# Altium project MiniPC.PrjPcb (part 7 of 17)

## Sheet Ethernet-HPS.SchDoc: 10/100/1000 Ethernet - HPS
size B; DocumentNumber: 8; SheetNumber: 8; SheetTotal: 46
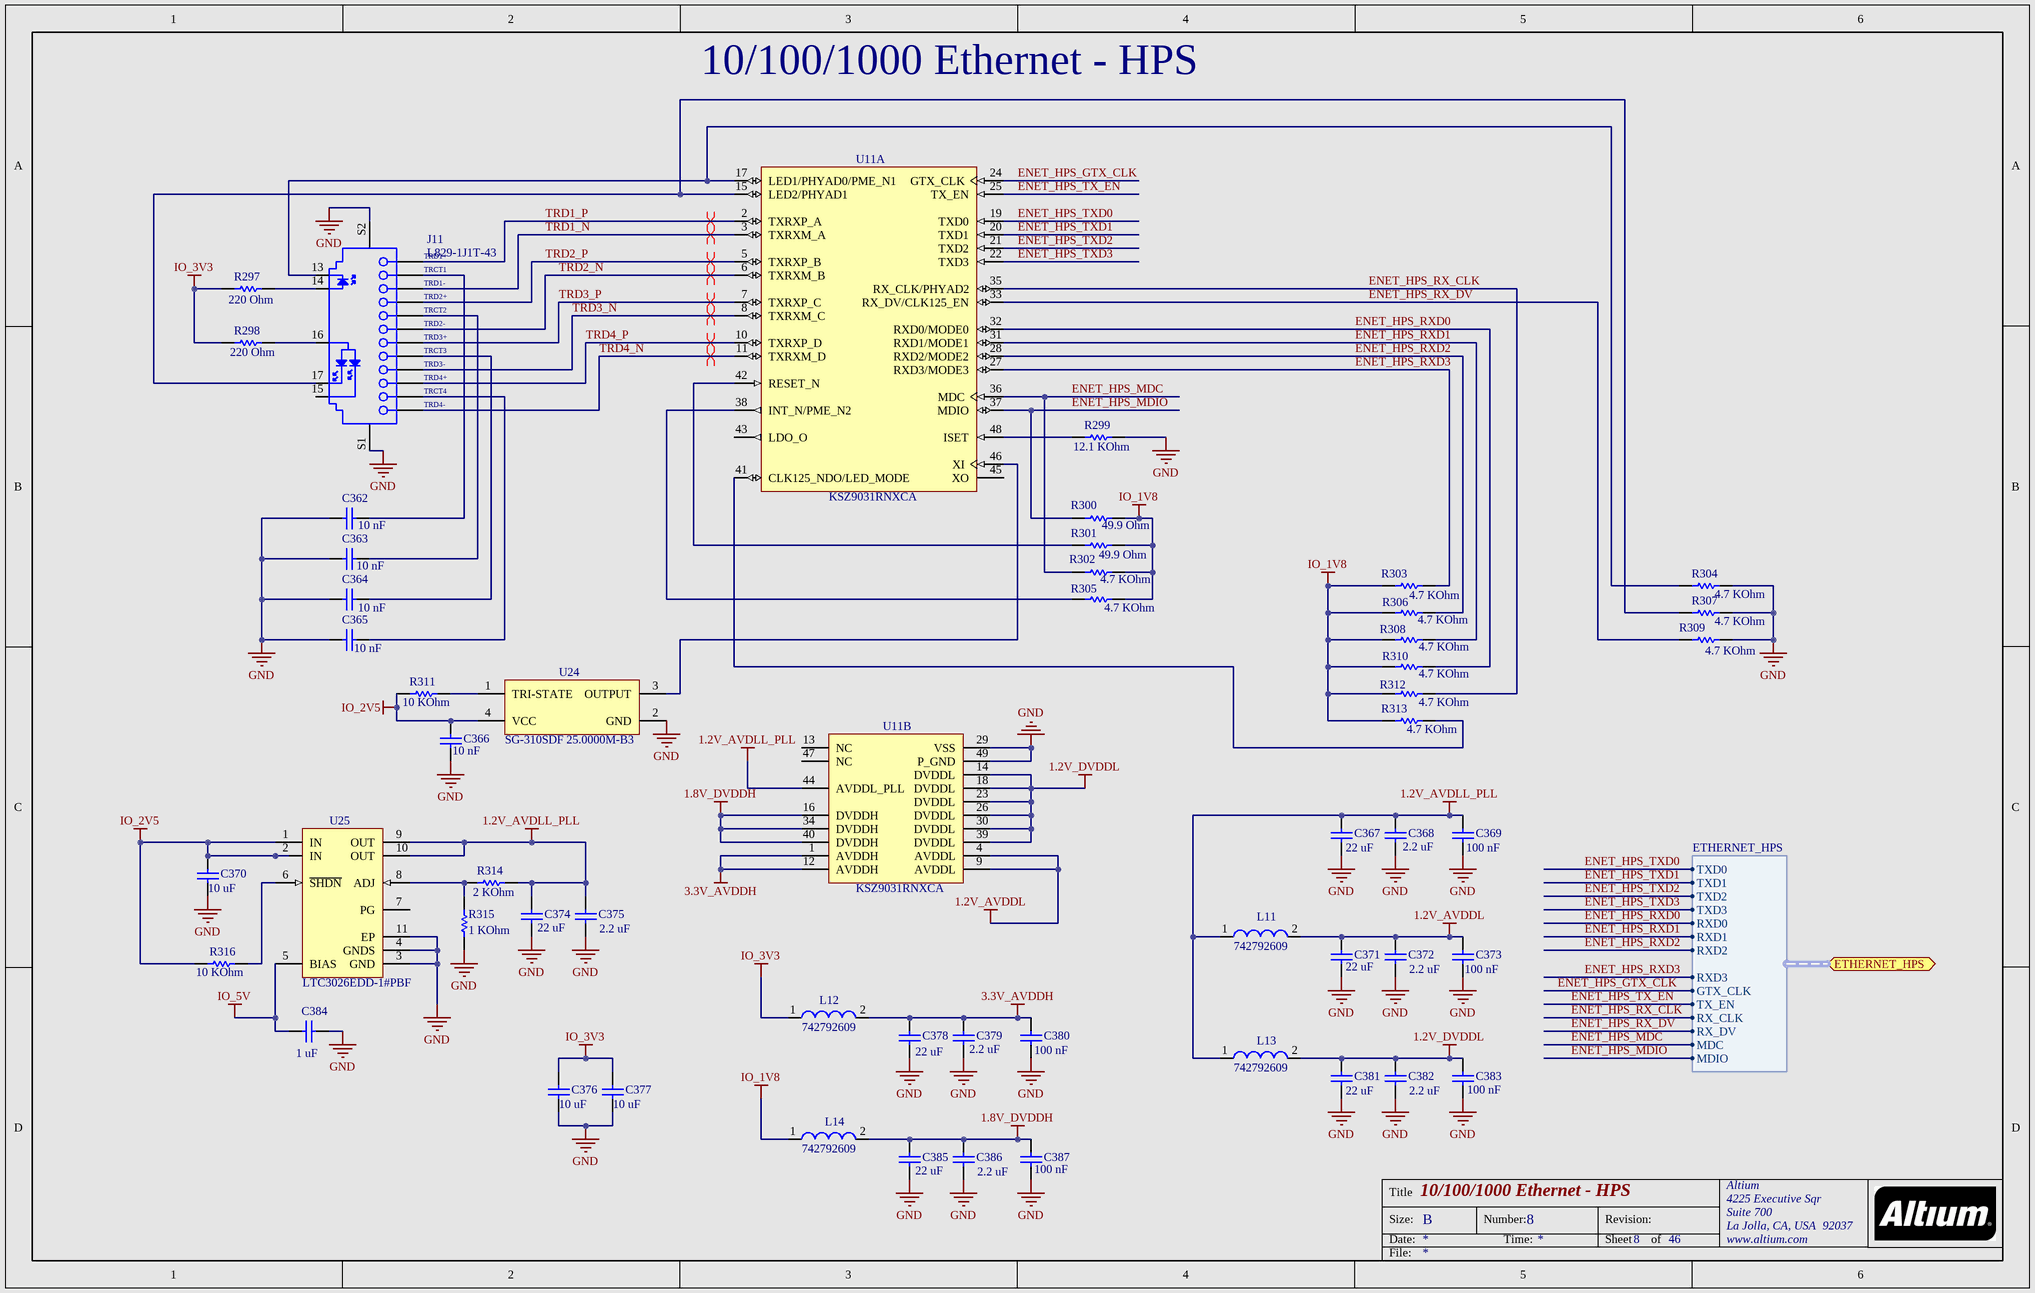
[diagram p24: Ethernet-HPS.SchDoc]

### Parts
C362  Capacitance: 10 nF  [CAPC1005X55X25ML05T10]  (hidden comment: GRM155R71H103KA88D)
C363  Capacitance: 10 nF  [CAPC1005X55X25ML05T10]  (hidden comment: GRM155R71H103KA88D)
C364  Capacitance: 10 nF  [CAPC1005X55X25ML05T10]  (hidden comment: GRM155R71H103KA88D)
C365  Capacitance: 10 nF  [CAPC1005X55X25ML05T10]  (hidden comment: GRM155R71H103KA88D)
C366  Capacitance: 10 nF  [CAPC1005X55X25ML05T10]  (hidden comment: GRM155R71H103KA88D)
C367  Capacitance: 22 uF  [CAPC3216X180X55ML20T25]  (hidden comment: GRM31CR61E226KE15L)
C368  Capacitance: 2.2 uF  [CAPC1608X90X35ML10T15]  (hidden comment: GRM188R61A225KE34x)
C369  Capacitance: 100 nF  [CAPC1005X55X10LL05]  (hidden comment: C1005X7R1E104M)
C370  Capacitance: 10 uF  [CAPC2013X100X20NL20]  (hidden comment: C2012X5R1C106K085AC)
C371  Capacitance: 22 uF  [CAPC3216X180X55ML20T25]  (hidden comment: GRM31CR61E226KE15L)
C372  Capacitance: 2.2 uF  [CAPC1608X90X35ML10T15]  (hidden comment: GRM188R61A225KE34x)
C373  Capacitance: 100 nF  [CAPC1005X55X10LL05]  (hidden comment: C1005X7R1E104M)
C374  Capacitance: 22 uF  [CAPC3216X180X55ML20T25]  (hidden comment: GRM31CR61E226KE15L)
C375  Capacitance: 2.2 uF  [CAPC1608X90X35ML10T15]  (hidden comment: GRM188R61A225KE34x)
C376  Capacitance: 10 uF  [CAPC2013X100X20NL20]  (hidden comment: C2012X5R1C106K085AC)
C377  Capacitance: 10 uF  [CAPC2013X100X20NL20]  (hidden comment: C2012X5R1C106K085AC)
C378  Capacitance: 22 uF  [CAPC3216X180X55ML20T25]  (hidden comment: GRM31CR61E226KE15L)
C379  Capacitance: 2.2 uF  [CAPC1608X90X35ML10T15]  (hidden comment: GRM188R61A225KE34x)
C380  Capacitance: 100 nF  [CAPC1005X55X10LL05]  (hidden comment: C1005X7R1E104M)
C381  Capacitance: 22 uF  [CAPC3216X180X55ML20T25]  (hidden comment: GRM31CR61E226KE15L)
C382  Capacitance: 2.2 uF  [CAPC1608X90X35ML10T15]  (hidden comment: GRM188R61A225KE34x)
C383  Capacitance: 100 nF  [CAPC1005X55X10LL05]  (hidden comment: C1005X7R1E104M)
C384  Capacitance: 1 uF  [CAPC1005X33X10LL5]  (hidden comment: CGB2A1X5R1E105K033BC)
C385  Capacitance: 22 uF  [CAPC3216X180X55ML20T25]  (hidden comment: GRM31CR61E226KE15L)
C386  Capacitance: 2.2 uF  [CAPC1608X90X35ML10T15]  (hidden comment: GRM188R61A225KE34x)
C387  Capacitance: 100 nF  [CAPC1005X55X10LL05]  (hidden comment: C1005X7R1E104M)
J11  L829-1J1T-43  [BELS-L829-1J1T-43_V]
L11  742792609  [SMD-0603]
L12  742792609  [SMD-0603]
L13  742792609  [SMD-0603]
L14  742792609  [SMD-0603]
R297  Resistance: 220 Ohm  [RESC1005X40X25LL05T05]  (hidden comment: ERJ-2GEJ221X)
R298  Resistance: 220 Ohm  [RESC1005X40X25LL05T05]  (hidden comment: ERJ-2GEJ221X)
R299  Resistance: 12.1 KOhm  [RESC1005X40X25LL05T05]  (hidden comment: CRCW040212K1FKED)
R300  Resistance: 49.9 Ohm  [RESC1005X35X25NL8T10]  (hidden comment: NRC04F49R9TRF)
R301  Resistance: 49.9 Ohm  [RESC1005X35X25NL8T10]  (hidden comment: NRC04F49R9TRF)
R302  Resistance: 4.7 KOhm  [RESC1005X40X25LL05T05]  (hidden comment: ERJ-2RKF4701X)
R303  Resistance: 4.7 KOhm  [RESC1005X40X25LL05T05]  (hidden comment: ERJ-2RKF4701X)
R304  Resistance: 4.7 KOhm  [RESC1005X40X25LL05T05]  (hidden comment: ERJ-2RKF4701X)
R305  Resistance: 4.7 KOhm  [RESC1005X40X25LL05T05]  (hidden comment: ERJ-2RKF4701X)
R306  Resistance: 4.7 KOhm  [RESC1005X40X25LL05T05]  (hidden comment: ERJ-2RKF4701X)
R307  Resistance: 4.7 KOhm  [RESC1005X40X25LL05T05]  (hidden comment: ERJ-2RKF4701X)
R308  Resistance: 4.7 KOhm  [RESC1005X40X25LL05T05]  (hidden comment: ERJ-2RKF4701X)
R309  Resistance: 4.7 KOhm  [RESC1005X40X25LL05T05]  (hidden comment: ERJ-2RKF4701X)
R310  Resistance: 4.7 KOhm  [RESC1005X40X25LL05T05]  (hidden comment: ERJ-2RKF4701X)
R311  Resistance: 10 KOhm  [RESC1005X40X25NL05T05]  (hidden comment: ERJ-2RKF1002X)
R312  Resistance: 4.7 KOhm  [RESC1005X40X25LL05T05]  (hidden comment: ERJ-2RKF4701X)
R313  Resistance: 4.7 KOhm  [RESC1005X40X25LL05T05]  (hidden comment: ERJ-2RKF4701X)
R314  Resistance: 2 KOhm  [RESC1005X40X25NL05T05]  (hidden comment: ERJ-2RKF2001X)
R315  Resistance: 1 KOhm  [RESC1005X40X25LL05T05]  (hidden comment: ERJ-2RKF1001X)
R316  Resistance: 10 KOhm  [RESC1005X40X25NL05T05]  (hidden comment: ERJ-2RKF1002X)
U11  KSZ9031RNXCA  [MICL-QFN-48_V]  (parts A,B of 2)
U24  SG-310SDF 25.0000M-B3  [EPSON-SG-310-4_V]
U25  LTC3026EDD-1#PBF  [LT-DD-10_V]

### Ports
ETHERNET_HPS (harness ETHERNET_HPS)

### Harnesses
ETHERNET_HPS: RXD2, RXD1, RXD0, TXD3, TXD2, TXD1, TXD0, RXD3, GTX_CLK, TX_EN, RX_DV, RX_CLK, MDC, MDIO

### Nets
1.2V_AVDDL: C371.2 C372.2 C373.2 L11.2 U11.4(AVDDL) U11.9(AVDDL)
1.2V_AVDLL_PLL: C367.2 C368.2 C369.2 C374.2 C375.2 L11.1 L13.1 R314.2 U11.44(AVDDL_PLL) U25.9(OUT) U25.10(OUT)
1.2V_DVDDL: C381.2 C382.2 C383.2 L13.2 U11.14(DVDDL) U11.18(DVDDL) U11.23(DVDDL) U11.26(DVDDL) U11.30(DVDDL) U11.39(DVDDL)
1.8V_DVDDH: C385.2 C386.2 C387.1 L14.2 U11.16(DVDDH) U11.34(DVDDH) U11.40(DVDDH)
3.3V_AVDDH: C378.2 C379.2 C380.2 L12.2 U11.1(AVDDH) U11.12(AVDDH)
GND: C362.1 C363.1 C364.1 C365.1 C366.1 C367.1 C368.1 C369.1 C370.1 C371.1 C372.1 C373.1 C374.1 C375.1 C376.1 C377.1 C378.1 C379.1 C380.1 C381.1 C382.1 C383.1 C384.1 C385.1 C386.1 C387.2 J11.S1 J11.S2 R299.2 R304.2 R307.2 R309.2 R315.1 U11.29(VSS) U11.49(P_GND) U24.2(GND) U25.3(GND) U25.4(GNDS) U25.11(EP)
IO_1V8: L14.1 R300.2 R301.2 R302.2 R303.1 R305.2 R306.1 R308.1 R310.1 R312.1 R313.1
IO_2V5: C366.2 C370.2 R311.1 R316.1 U24.4(VCC) U25.1(IN) U25.2(IN)
IO_3V3: C376.2 C377.2 L12.1 R297.1 R298.1
IO_5V: C384.2 U25.5(BIAS)
ENET_HPS_GTX_CLK: U11.24(GTX_CLK) ; port ETHERNET_HPS.GTX_CLK
ENET_HPS_MDC: R302.1 U11.36(MDC) ; port ETHERNET_HPS.MDC
ENET_HPS_MDIO: R300.1 U11.37(MDIO) ; port ETHERNET_HPS.MDIO
ENET_HPS_RX_CLK: R312.2 U11.35(RX_CLK/PHYAD2) ; port ETHERNET_HPS.RX_CLK
ENET_HPS_RX_DV: R309.1 U11.33(RX_DV/CLK125_EN) ; port ETHERNET_HPS.RX_DV
ENET_HPS_RXD0: R310.2 U11.32(RXD0/MODE0) ; port ETHERNET_HPS.RXD0
ENET_HPS_RXD1: R308.2 U11.31(RXD1/MODE1) ; port ETHERNET_HPS.RXD1
ENET_HPS_RXD2: R306.2 U11.28(RXD2/MODE2) ; port ETHERNET_HPS.RXD2
ENET_HPS_RXD3: R303.2 U11.27(RXD3/MODE3) ; port ETHERNET_HPS.RXD3
ENET_HPS_TX_EN: U11.25(TX_EN) ; port ETHERNET_HPS.TX_EN
ENET_HPS_TXD0: U11.19(TXD0) ; port ETHERNET_HPS.TXD0
ENET_HPS_TXD1: U11.20(TXD1) ; port ETHERNET_HPS.TXD1
ENET_HPS_TXD2: U11.21(TXD2) ; port ETHERNET_HPS.TXD2
ENET_HPS_TXD3: U11.22(TXD3) ; port ETHERNET_HPS.TXD3
TRD1_N: J11.3(TRD1-) U11.3(TXRXM_A)
TRD1_P: J11.1(TRD1+) U11.2(TXRXP_A)
TRD2_N: J11.6(TRD2-) U11.6(TXRXM_B)
TRD2_P: J11.4(TRD2+) U11.5(TXRXP_B)
TRD3_N: J11.9(TRD3-) U11.8(TXRXM_C)
TRD3_P: J11.7(TRD3+) U11.7(TXRXP_C)
TRD4_N: J11.12(TRD4-) U11.11(TXRXM_D)
TRD4_P: J11.10(TRD4+) U11.10(TXRXP_D)
NetC362_2: C362.2 J11.2(TRCT1)
NetC363_2: C363.2 J11.5(TRCT2)
NetC364_2: C364.2 J11.8(TRCT3)
NetC365_2: C365.2 J11.11(TRCT4)
NetJ11_13: J11.13 R304.1 U11.17(LED1/PHYAD0/PME_N1)
NetJ11_14: J11.14 R297.2
NetJ11_16: J11.16 R298.2
NetJ11_17: J11.17 R307.1 U11.15(LED2/PHYAD1)
NetR299_1: R299.1 U11.48(ISET)
NetR301_1: R301.1 U11.42(RESET_N)
NetR305_1: R305.1 U11.38(INT_N/PME_N2)
NetR311_2: R311.2 U24.1(TRI-STATE)
NetR313_2: R313.2 U11.41(CLK125_NDO/LED_MODE)
NetR314_1: R314.1 R315.2 U25.8(ADJ)
NetR316_2: R316.2 U25.6(~{SHDN})
NetU11_46: U11.46(XI) U24.3(OUTPUT)

Not connected (* = marked no-connect by the designer): J11 15; U11 13(NC) 43(LDO_O) 45(XO) 47(NC); U25 7(PG)

### Layout directives
differential pair: TRD1_N, TRD1_P, TRD2_N, TRD2_P, TRD3_N, TRD3_P, TRD4_N, TRD4_P

### Notes on the sheet
- Title
- Size:
- Date:
- B
- Number:
- Time:
- Revision:
- Sheet
- of
- File:

### Library data of the parts
C362-C366 = CMP-2008-04637-4: Chip Capacitor, 10 nF, +/- 10%, 50 V, -55 to 125 degC, 0402 (1005 Metric), RoHS, Tape and Reel; Manufacturer: Basic Passives; Voltage Rating: 50 V; Case\/Package: 0402; Type (Capacitors): X7R; Mounting Technology: Surface Mount; Max Operating Temperature: 125 degC; Height: 0.5 mm; PackageDescription: 2-Pin Surface Mount Device, Body 1 x 0.5 mm; Case Code (Imperial): 0402; Tolerance: 10%; ComponentLink1URL: http://www.murata.com/; RoHSCompliant: true; Width: 0.5 mm; Package Quantity: 10000; Packaging: Tape and Reel; ComponentLink1Description: Manufacturer URL; Min Operating Temperature: -55 degC; PartNumber: GRM155R71H103KA88D; REACH SVHC: No SVHC; Case Code (Metric): 1005; Length: 1 mm; DatasheetVersion: 02/2016; Mount: Surface Mount; Radiation Hardening: No; Lead Pitch: 2mm; Voltage Rating (DC): 50 V; Pins: 2; ComponentLink2URL: http://search.murata.co.jp/Ceramy/image/img/A01X/G101/ENG/GRM155R71H103KA88-01.pdf; ComponentLink2Description: Datasheet; PackageReference: 0402
C367 C371 C374 C378 C381 C385 = CMP-1662-00010-2: Chip Capacitor, 22 uF, +/- 10%, 25 V, -55 to 85 degC, 1206 (3216 Metric), RoHS, Tape and Reel; Voltage Rating (DC): 25 V; Case\/Package: 1206; Type (Capacitors): X5R; Tolerance: 10%; Max Operating Temperature: 85 degC; Package Quantity: 2000; Voltage Rating: 25 V; Case Code (Metric): 3216; Length: 3.2 mm; PackageDescription: 2-Pin Surface Mount Device, Body 3.2 x 1.6 mm; ComponentLink1Description: Manufacturer URL; Case Code (Imperial): 1206; ComponentLink1URL: http://www.murata.com/; Radiation Hardening: No; Height: 1.6 mm; Width: 1.6 mm; DatasheetVersion: 03/2016; Min Operating Temperature: -55 degC; Mount: Surface Mount; REACH SVHC: No SVHC; PackageReference: 1206; ComponentLink2URL: http://search.murata.co.jp/Ceramy/image/img/A01X/G101/ENG/GRM31CR61E226KE15-01.pdf; Packaging: Tape and Reel; RoHSCompliant: true; ComponentLink2Description: Datasheet; Mounting Technology: Surface Mount; PartNumber: GRM31CR61E226KE15L; Pins: 2
C368 C372 C375 C379 C382 C386 = CMP-1662-00016-2: Chip Capacitor, 2.2 uF, +/- 10%, 10 V, -55 to 85 degC, 0603 (1608 Metric), RoHS, Tape and Reel; Tolerance: 10%; Width: 0.031 inch; DatasheetVersion: 01/2013; Case/Package: 0603; Length: 0.063 inch; PartNumber: GRM188R61A225KE34x; Package Quantity: 10000; Case Code (Imperial): 0603; Packaging: Tape and Reel; PackageDescription: 2-Pin Surface Mount Device, Body 1.6 x 0.8 mm; Case Code (Metric): 1608; ComponentLink1Description: Manufacturer URL; Radiation Hardening: No; Mounting Technology: Surface Mount; Height: 0.8 mm; RoHSCompliant: True; ComponentLink2URL: https://datasheet.ciiva.com/134/grm188r61a225ke34-01-134206.pdf; ComponentLink2Description: Datasheet; Max Operating Temperature: 85 degC; Min Operating Temperature: -55 degC; ComponentLink1URL: http://www.murata.com/
C369 C373 C380 C383 C387 = CMP-1663-00009-2: Chip Capacitor, 0.1 uF, +/- 20%, 25 V, -55 to 125 degC, 0402 (1005 Metric), RoHS, Tape and Reel; Type (Capacitors): X7R; Voltage Rating: 25 V; Case\/Package: 0402; Tolerance: 20%; Mounting Technology: Surface Mount; Max Operating Temperature: 125 degC; ComponentLink2URL: http://www.farnell.com/datasheets/1571323.pdf; ComponentLink1URL: http://www.tdk.com/; RoHSCompliant: true; Packaging: Tape and Reel; ComponentLink2Description: Datasheet; Case Code (Imperial): 0402; DatasheetVersion: 09/2011; ComponentLink1Description: Manufacturer URL; PackageDescription: 2-Pin Surface Mount Device, Body 1 x 0.5 mm; PackageReference: 0402; Min Operating Temperature: -55 degC; Case Code (Metric): 1005; Height: 0.5 mm; Package Quantity: 10000; Width: 0.5 mm; Pins: 2; Voltage Rating (DC): 25 V; PartNumber: C1005X7R1E104M; Mount: Surface Mount; Length: 1 mm
C370 C376 C377 = CMP-1663-00007-1: Chip Capacitor, 10 uF, +/- 10%, 16 V, -55 to 85 degC, 0805 (2012 Metric), RoHS, Tape and Reel; Type (Capacitors): X5R; Voltage Rating (DC): 16 V; Case\/Package: 0805; Tolerance: 10%; Mounting Technology: Surface Mount; Min Operating Temperature: -55 degC; Length: 2 mm; Case Code (Metric): 2012; PackageReference: 0805; Voltage Rating: 16 V; RoHSCompliant: true; ComponentLink1Description: Manufacturer URL; Width: 1.25 mm; ComponentLink1URL: http://www.tdk.com/; Max Operating Temperature: 85 degC; REACH SVHC: No SVHC; Mount: Surface Mount; ComponentLink2URL: https://product.tdk.com/info/en/catalog/datasheets/mlcc_commercial_general_en.pdf; ComponentLink2Description: Datasheet; Pins: 2; Packaging: Tape and Reel; Height: 0.85 mm; Package Quantity: 1; DatasheetVersion: 03/2015; Case Code (Imperial): 0805; PackageDescription: 2-Pin Surface Mount Device, Body 2 x 1.25 mm
C384 = CMP-1663-00006-2: Chip Capacitor, 1 uF, +/- 10%, 25 V, -55 to 85 degC, 0402 (1005 Metric), RoHS, Tape and Reel; DatasheetVersion: 04/2015; Mounting Technology: Surface Mount; ComponentLink2Description: Datasheet; PackageDescription: 2-Pin Surface Mount Device, Body 1 x 0.5 mm; ComponentLink1URL: http://www.tdk.com/; ComponentLink1Description: Manufacturer URL; ComponentLink2URL: https://product.tdk.com/info/en/catalog/datasheets/mlcc_commercial_lowprofile_en.pdf; PartNumber: CGB2A1X5R1E105K033BC; Case Code (Metric): 1005; RoHSCompliant: True; Max Operating Temperature: 85 degC; Package Quantity: 1; Width: 0.02 inch; Case/Package: 0402; Case Code (Imperial): 0402; Packaging: Tape and Reel; Tolerance: 10%; Length: 0.039 inch; Min Operating Temperature: -55 degC
J11 = CMP-1715-00001-1: Gigabit MagJack(R) Ultra Low Profile, 10/100/1000 Base-T, 19-Pin THD, RoHS, Tray; Width: 24.13 mm; RoHSCompliant: True; PartNumber: L829-1J1T-43; Case/Package: Metal; Mount: Through Hole; ComponentLink1Description: Manufacturer URL; Height: 11.3 mm; Package Quantity: 60; Packaging: Tray; Length: 17.78 mm; PackageDescription: 19-Pin Through Hole Device, Body 23.94 x 17.58 mm, Pitch 2.03 mm; ComponentLink2URL: http://belfuse.com/pdfs/L829-1J1T-43.pdf; ComponentLink1URL: http://belfuse.com/ethernet/; Mounting Technology: Through Hole; DatasheetVersion: Rev. G; Pins: 8; ComponentLink2Description: Datasheet
L11-L14 = CMP-0220-00193-1: SMD EMI Suppression Ferrite Bead WE-CBF, Z = 30 Ohm; Impedance: 30 Ohm; Value: 30Ohm; ComponentLink2URL: http://www.we-online.de/katalog/media/pdf/742792609.pdf; ComponentLink1URL: http://www.we-online.com; ComponentLink2Description: Datasheet; PackageDescription: Chip Inductor, 2-Leads, Body 1.6 x 0.8 mm; ComponentLink1Description: Manufacturer Link; PackageReference: SMD-0603; DatasheetVersion: Dec-2005; PackageVersion: 2009
R297 R298 = CMP-2002-00487-3: Chip Resistor, 220 Ohm, +/- 5%, 100 mW, -55 to 155 degC, 0402 (1005 Metric), RoHS, Tape and Reel; Manufacturer: Basic Passives; Power Rating: 100 mW; Voltage Rating: 50 V; Case\/Package: 0402; Length: 1 mm; RoHSCompliant: true; PackageDescription: 2-Pin Surface Mount Device, Body 1 x 0.5 mm; ComponentLink1Description: Manufacturer URL; Height: 0.35 mm; Mounting Technology: Surface Mount; Packaging: Tape and Reel; Case Code (Metric): 1005; Min Operating Temperature: -55 degC; Mount: Surface Mount; PartNumber: ERJ-2GEJ221X; Tolerance: 5%; Package Quantity: 10000; ComponentLink1URL: http://www.panasonic.com/; Width: 0.5 mm; REACH SVHC: Unknown; Max Operating Temperature: 155 degC; Case Code (Imperial): 0402; PackageReference: 0402; Pins: 2; ComponentLink2URL: http://industrial.panasonic.com/cdbs/www-data/pdf/RDA0000/AOA0000C84.pdf; ComponentLink2Description: Datasheet; DatasheetVersion: 04/2015; Radiation Hardening: No
R299 = CMP-2002-08179-3: Chip Resistor, 12.1 KOhm, +/- 1%, 63 mW, -55 to 155 degC, 0402 (1005 Metric), RoHS, Tape and Reel; Manufacturer: Basic Passives; Voltage Rating: 50 V; Power Rating: 63 mW; Case\/Package: 0402; Height: 0.35 mm; Mounting Technology: Surface Mount; ComponentLink1URL: http://www.vishay.com/; Case Code (Imperial): 0402; REACH SVHC: Unknown; PartNumber: CRCW040212K1FKED; Packaging: Tape and Reel; Mount: Surface Mount; ComponentLink1Description: Manufacturer URL; Length: 1 mm; Max Operating Temperature: 155 degC; PackageDescription: 2-Pin Surface Mount Device, Body 1 x 0.5 mm; Tolerance: 1%; Width: 0.5 mm; RoHSCompliant: true; Package Quantity: 10000; Case Code (Metric): 1005; Min Operating Temperature: -55 degC; ComponentLink2URL: http://www.vishay.com/docs/20035/dcrcwe3.pdf; ComponentLink2Description: Datasheet; Pins: 2; DatasheetVersion: 06/2012; Weight: 2.3E-05oz; Radiation Hardening: No; PackageReference: 0402
R300 R301 = CMP-1599-00001-2: Chip Resistor, 49.9 Ohm, +/- 1%, 0.06 W, -55 to 155 degC, 0402 (1005 Metric), RoHS, Tape and Reel; Tolerance: 1%; ComponentLink2Description: Datasheet; RoHSCompliant: True; DatasheetVersion: 11/2008; Max Operating Temperature: 155 degC; PartNumber: NRC04F49R9TRF; Radiation Hardening: No; PackageDescription: 2-Pin Surface Mount Device, Body 1 x 0.5 mm; Case/Package: 0402; Height: 0.3 mm; Length: 1 mm; ComponentLink1Description: Manufacturer URL; ComponentLink1URL: http://www.niccomp.com/; Mounting Technology: Surface Mount; Packaging: Tape and Reel; ComponentLink2URL: https://datasheet.ciiva.com/27056/2008575-27056094.pdf; Min Operating Temperature: -55 degC
R302-R310 R312 R313 = CMP-1665-00031-3: Chip Resistor, 4.7 KOhm, +/- 1%, 0.1 W, -55 to 155 degC, 0402 (1005 Metric), RoHS, Tape and Reel; Voltage Rating: 50 V; Case\/Package: 0402; Power Rating: 100 mW; Tolerance: 1%; Case Code (Imperial): 0402; PartNumber: ERJ-2RKF4701X; Mounting Technology: Surface Mount; ComponentLink1Description: Manufacturer URL; Width: 0.5 mm; DatasheetVersion: 04/2015; PackageDescription: 2-Pin Surface Mount Device, Body 1 x 0.5 mm; ComponentLink2Description: Datasheet; Packaging: Cut Tape; RoHSCompliant: true; Package Quantity: 1; Height: 0.35 mm; REACH SVHC: Yes; Case Code (Metric): 1005; Max Operating Temperature: 155 degC; ComponentLink1URL: http://www.panasonic.com/; Radiation Hardening: No; ComponentLink2URL: http://industrial.panasonic.com/cdbs/www-data/pdf/RDA0000/AOA0000C86.pdf; Min Operating Temperature: -55 degC; Length: 1 mm; Pins: 2; PackageReference: 0402; Mount: Surface Mount
R311 R316 = CMP-2002-00607-3: Chip Resistor, 10 KOhm, +/- 1%, 100 mW, -55 to 155 degC, 0402 (1005 Metric), RoHS, Tape and Reel; Manufacturer: Basic Passives; Voltage Rating: 50 V; Power Rating: 100 mW; Case\/Package: 0402; Case Code (Imperial): 0402; Min Operating Temperature: -55 degC; PartNumber: ERJ-2RKF1002X; Mounting Technology: Surface Mount; Length: 1 mm; Packaging: Tape and Reel; ComponentLink1Description: Manufacturer URL; Mount: Surface Mount; Package Quantity: 10000; Max Operating Temperature: 155 degC; Case Code (Metric): 1005; Height: 0.35 mm; ComponentLink1URL: http://www.panasonic.com/; Tolerance: 1%; REACH SVHC: Yes; RoHSCompliant: true; Width: 0.5 mm; PackageDescription: 2-Pin Surface Mount Device, Body 1 x 0.5 mm; Radiation Hardening: No; PackageReference: 0402; ComponentLink2Description: Datasheet; DatasheetVersion: 04/2015; ComponentLink2URL: http://industrial.panasonic.com/cdbs/www-data/pdf/RDA0000/AOA0000C86.pdf; Pins: 2
R314 = CMP-2002-00758-3: Chip Resistor, 2 KOhm, +/- 1%, 100 mW, -55 to 155 degC, 0402 (1005 Metric), RoHS, Tape and Reel; Manufacturer: Basic Passives; Voltage Rating: 50 V; Power Rating: 100 mW; Case\/Package: 0402; Min Operating Temperature: -55 degC; Tolerance: 1%; REACH SVHC: Unknown; Case Code (Metric): 1005; PackageDescription: 2-Pin Surface Mount Device, Body 1 x 0.5 mm; RoHSCompliant: true; Packaging: Tape and Reel; Length: 1 mm; ComponentLink1Description: Manufacturer URL; Case Code (Imperial): 0402; Mounting Technology: Surface Mount; Package Quantity: 10000; Height: 0.35 mm; Width: 0.5 mm; Mount: Surface Mount; ComponentLink1URL: http://www.panasonic.com/; PartNumber: ERJ-2RKF2001X; Max Operating Temperature: 155 degC; PackageReference: 0402; DatasheetVersion: 04/2015; Pins: 2; Radiation Hardening: No; ComponentLink2Description: Datasheet; ComponentLink2URL: http://industrial.panasonic.com/cdbs/www-data/pdf/RDA0000/AOA0000C86.pdf
R315 = CMP-2002-00606-3: Chip Resistor, 1 KOhm, +/- 1%, 100 mW, -55 to 155 degC, 0402 (1005 Metric), RoHS, Tape and Reel; Manufacturer: Basic Passives; Voltage Rating: 50 V; Power Rating: 100 mW; Case\/Package: 0402; PartNumber: ERJ-2RKF1001X; Width: 0.5 mm; ComponentLink1URL: http://www.panasonic.com/; Length: 1 mm; Min Operating Temperature: -55 degC; PackageDescription: 2-Pin Surface Mount Device, Body 1 x 0.5 mm; Case Code (Metric): 1005; Height: 0.35 mm; ComponentLink1Description: Manufacturer URL; Mounting Technology: Surface Mount; Tolerance: 1%; Packaging: Tape and Reel; Package Quantity: 10000; REACH SVHC: Yes; Max Operating Temperature: 155 degC; Mount: Surface Mount; RoHSCompliant: true; Case Code (Imperial): 0402; DatasheetVersion: 04/2015; Radiation Hardening: No; Pins: 2; ComponentLink2Description: Datasheet; PackageReference: 0402; ComponentLink2URL: http://industrial.panasonic.com/cdbs/www-data/pdf/RDA0000/AOA0000C86.pdf
U11 = CMP-1337-00004-2: Gigabit Ethernet Transceiver with RGMII Support, 1.14 to 1.26 V, 0 to 70 degC, 48-Pin QFN, RoHS; Manufacturer: Micrel; ILED: 8 mA Typ.; Drivers: 4; VSET@R(ISET): 12.1 KOhm=1.2 V Typ.; Output Tri-State Leakage: 10 uA Max.; ComponentLink2URL: http://www.micrel.com/_PDF/Ethernet/datasheets/KSZ9031RNX.pdf; ComponentLink1Description: Manufacturer URL; ComponentLink3Description: Package Specification; DatasheetVersion: Rev. 2.1; ComponentLink2Description: Datasheet; Receivers: 4; Temperature Range: 0 to 70 degC; PackageDescription: 48-Pin Quad Flat Non-Lead Package, Body 7 x 7 mm, Pitch 0.5 mm; PartNumber: KSZ9031RNXCA; ComponentLink1URL: http://www.micrel.com/; ComponentLink3URL: http://www.micrel.com/_PDF/Ethernet/datasheets/KSZ9031RNX.pdf; Mounting Technology: Surface Mount; RoHS: TRUE; DVDDL: 1.14 to 1.26 V
U24 = CMP-1695-00002-3: Crystal Oscillator (SPXO), 2.5 V, 25 MHz, -20 to 70 degC, 4-Pin SMD, RoHS, Tape and Reel; ComponentLink2URL: http://www5.epsondevice.com/en/products/spxo_standard/sg310sdf.html#; DatasheetVersion: Rev. Feb-15; ComponentLink1Description: Manufacturer URL; ComponentLink1URL: https://www.eea.epson.com/; Mounting Technology: Surface Mount; PartNumber: SG-310SDF 25.0000M-B3; PackageDescription: 4-Pin Surface Mount Device, Body 3.2 x 2.5 mm; ComponentLink2Description: Datasheet; Max Operating Temperature: 70 degC; Length: 3.2 mm; Packaging: Tape and Reel; Height: 1.05 mm; RoHSCompliant: True; Min Operating Temperature: -20 degC; Width: 2.5 mm
U25 = CMP-0476-00185-2: 1.5 A Low Input Voltage VLDO Linear Regulator, Boost Converter Disabled, Require 5 V External Supply, 1.14 to 5.5 V Vin, Adjustable Vout, 10-pin SON (DD-10), -40 to 125 degC, Pb-Free; Manufacturer: Linear Technology; Output Voltage: Adj; Vin Max(V): 5.5; Iout(mA): 1500; Discrete Pass Element: no; Isupply(mA): 0.095; Vin Min(V): 1.14; PSRR(dB): 42; Noise(uV): 110; Vout Min(V): 0.4; Shutdown Current(uA): 0.6; Dropout Voltage(V): 0.1; Vout Max(V): 2.6; Number of Outputs: 1; ComponentLink2URL: http://cds.linear.com/docs/en/datasheet/30261f.pdf; Code_JEDEC: MO-229; PackageVersion: Rev. C, 06/2010; PackageDescription: 10-Pin Plastic DFN, Body 3 x 3 mm, Pitch 0.5 mm; PackageReference: DD-10; ComponentLink1URL: http://www.linear.com/; PartNumber: LTC3026EDD-1#PBF; RoHS: TRUE; ComponentLink1Description: Manufacturer URL; ComponentLink3URL: http://cds.linear.com/docs/en/packaging/DFN_10_05-08-1699.pdf; ComponentLink3Description: Package Specification; Mounting Technology: Surface Mount; ComponentLink2Description: Datasheet

## Sheet SFP_PortA.SchDoc: Small Form Factor Pluggable Plus
size B; DocumentNumber: 14; SheetNumber: 14; SheetTotal: 46
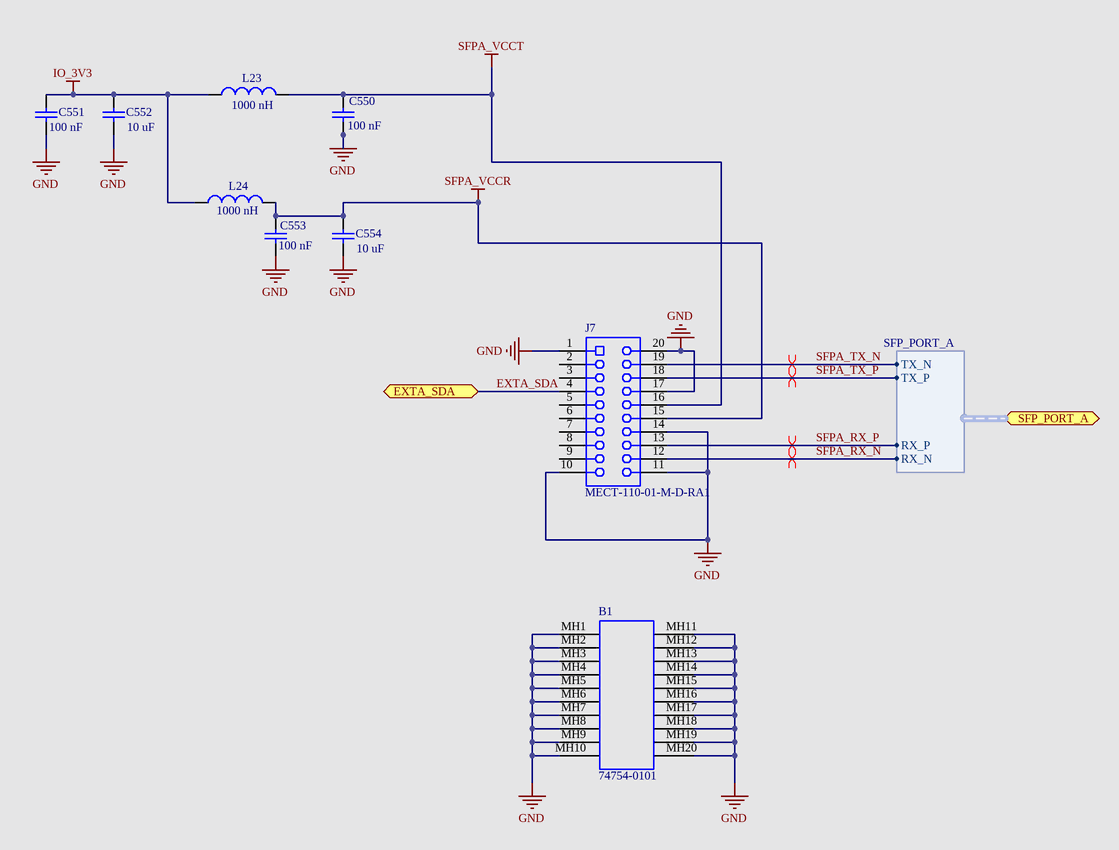
[diagram p25: SFP_PortA.SchDoc]

### Parts
B1  74754-0101  [MOLX-74754-0101_V]
C550  Capacitance: 100 nF  [CAPC1005X55X10LL05]  (hidden comment: C1005X7R1E104M)
C551  Capacitance: 100 nF  [CAPC1005X55X10LL05]  (hidden comment: C1005X7R1E104M)
C552  Capacitance: 10 uF  [CAPC2013X100X20NL20]  (hidden comment: C2012X5R1C106K085AC)
C553  Capacitance: 100 nF  [CAPC1005X55X10LL05]  (hidden comment: C1005X7R1E104M)
C554  Capacitance: 10 uF  [CAPC2013X100X20NL20]  (hidden comment: C2012X5R1C106K085AC)
J7  MECT-110-01-M-D-RA1  [SMTC-MECT-110-01-M-D-RA1_V]
L23  Inductance: 1000 nH  [COIL-1008CS_V]  (hidden comment: 1008CS-102XFLC)
L24  Inductance: 1000 nH  [COIL-1008CS_V]  (hidden comment: 1008CS-102XFLC)

### Ports
EXTA_SDA (bidir), SFP_PORT_A (harness SFP_PORT_A)

### Harnesses
SFP_PORT_A: TX_P, TX_N, RX_P, RX_N

### Nets
GND: B1.MH1 B1.MH2 B1.MH3 B1.MH4 B1.MH5 B1.MH6 B1.MH7 B1.MH8 B1.MH9 B1.MH10 B1.MH11 B1.MH12 B1.MH13 B1.MH14 B1.MH15 B1.MH16 B1.MH17 B1.MH18 B1.MH19 B1.MH20 C550.1 C551.1 C552.1 C553.1 C554.1 J7.1 J7.10 J7.11 J7.14 J7.17 J7.20
IO_3V3: C551.2 C552.2 L23.1 L24.1
SFPA_VCCR: C553.2 C554.2 J7.15 L24.2
SFPA_VCCT: C550.2 J7.16 L23.2
EXTA_SDA: J7.4 ; port EXTA_SDA
SFPA_RX_N: J7.12 ; port SFP_PORT_A.RX_N
SFPA_RX_P: J7.13 ; port SFP_PORT_A.RX_P
SFPA_TX_N: J7.19 ; port SFP_PORT_A.TX_N
SFPA_TX_P: J7.18 ; port SFP_PORT_A.TX_P

Not connected (* = marked no-connect by the designer): J7 2 3 5 6 7 8 9

### Layout directives
differential pair: SFPA_RX_N, SFPA_RX_P, SFPA_TX_N, SFPA_TX_P

### Notes on the sheet
- Title
- Size:
- Date:
- B
- Number:
- Time:
- Revision:
- Sheet
- of
- File:

### Library data of the parts
B1 = CMP-1704-00003-1: SFP+ Cage, Single Port, Height 10.85 mm, Tail Height 3.05 mm, -40 to 85 degC, RoHS, Tray; Manufacturer: Molex; ComponentLink1URL: http://www.molex.com/; PartNumber: 74754-0101; Mounting Technology: Through Hole; PackageDescription: SFP+ Cage, Single Port, Height 10.85 mm, Tail Height 3.05 mm; ComponentLink2Description: Datasheet; DatasheetVersion: Rev. Jul-15; PackageVersion: Rev. J, 02/2015; ComponentLink1Description: Manufacturer URL; ComponentLink2URL: http://www.molex.com/webdocs/datasheets/pdf/en-us/0747540101_IO_CONNECTORS.pdf; ComponentLink3Description: Package Specification; PackageReference: 74754-0101; ComponentLink3URL: http://www.molex.com/pdm_docs/sd/747540101_sd.pdf
C550 C551 C553 = CMP-1663-00009-2: as C369 on sheet Ethernet-HPS; Tolerance: 20%; Max Operating Temperature: 125 degC; ComponentLink2URL: http://www.farnell.com/datasheets/1571323.pdf; ComponentLink1URL: http://www.tdk.com/; RoHSCompliant: true; Packaging: Tape and Reel; Mounting Technology: Surface Mount; ComponentLink2Description: Datasheet; Case Code (Imperial): 0402; DatasheetVersion: 09/2011; ComponentLink1Description: Manufacturer URL; PackageDescription: 2-Pin Surface Mount Device, Body 1 x 0.5 mm; PackageReference: 0402; Min Operating Temperature: -55 degC; Case Code (Metric): 1005; Height: 0.5 mm; Package Quantity: 10000; Width: 0.5 mm; Pins: 2; Voltage Rating (DC): 25 V; PartNumber: C1005X7R1E104M; Mount: Surface Mount; Length: 1 mm
C552 C554 = CMP-1663-00007-1: as C370 on sheet Ethernet-HPS; Tolerance: 10%; Mounting Technology: Surface Mount; Min Operating Temperature: -55 degC; Length: 2 mm; Case Code (Metric): 2012; PackageReference: 0805; Voltage Rating: 16 V; RoHSCompliant: true; ComponentLink1Description: Manufacturer URL; Width: 1.25 mm; ComponentLink1URL: http://www.tdk.com/; Max Operating Temperature: 85 degC; REACH SVHC: No SVHC; Mount: Surface Mount; ComponentLink2URL: https://product.tdk.com/info/en/catalog/datasheets/mlcc_commercial_general_en.pdf; ComponentLink2Description: Datasheet; Pins: 2; Packaging: Tape and Reel; Height: 0.85 mm; Package Quantity: 1; DatasheetVersion: 03/2015; Case Code (Imperial): 0805; PackageDescription: 2-Pin Surface Mount Device, Body 2 x 1.25 mm
J7 = CMP-1707-00001-1: Female Transceiver Interface, Pitch 0.8 mm, 2 x 10 Position, Height 5.2 mm, -55 to 125 degC, RoHS, Tube; Manufacturer: Samtec; ComponentLink1URL: http://www.samtec.com/; ComponentLink2Description: Datasheet; ComponentLink2URL: http://suddendocs.samtec.com/catalog_english/mect.pdf; PartNumber: MECT-110-01-M-D-RA1; PackageDescription: Female Transceiver Interface, Pitch 0.8 mm, 2 x 10 Position, Height 5.2 mm; Mounting Technology: Surface Mount; ComponentLink3Description: Package Specification; ComponentLink1Description: Manufacturer URL; DatasheetVersion: Rev. Feb-16; PackageReference: MECT-110-01-M-D-RA1; PackageVersion: Rev. H, 06/2016; ComponentLink3URL: http://suddendocs.samtec.com/prints/mect-1xx-xx-xx-xx-d-rax-xx-footprint.pdf
L23 L24 = CMP-1716-00001-2: Chip Inductor, 1000 nH, +/- 1%, -40 to 125 degC, 2-Pin SMD, RoHS, Tape and Reel; DatasheetVersion: 01/2012; ComponentLink2URL: http://datasheet.octopart.com/1008CS-102XFLC-Coilcraft-datasheet-10791557.pdf; ComponentLink1Description: Manufacturer URL; PartNumber: 1008CS-102XFLC; ComponentLink1URL: http://www.coilcraft.com/; PackageDescription: 2-Pin Surface Mount Device, Body 2.92 x 2.79 mm; RoHSCompliant: False; ComponentLink2Description: Datasheet; Mounting Technology: Surface Mount

## Sheet SFP_PortB.SchDoc: Small Form Factor Pluggable Plus
size B; DocumentNumber: 15; SheetNumber: 15; SheetTotal: 46
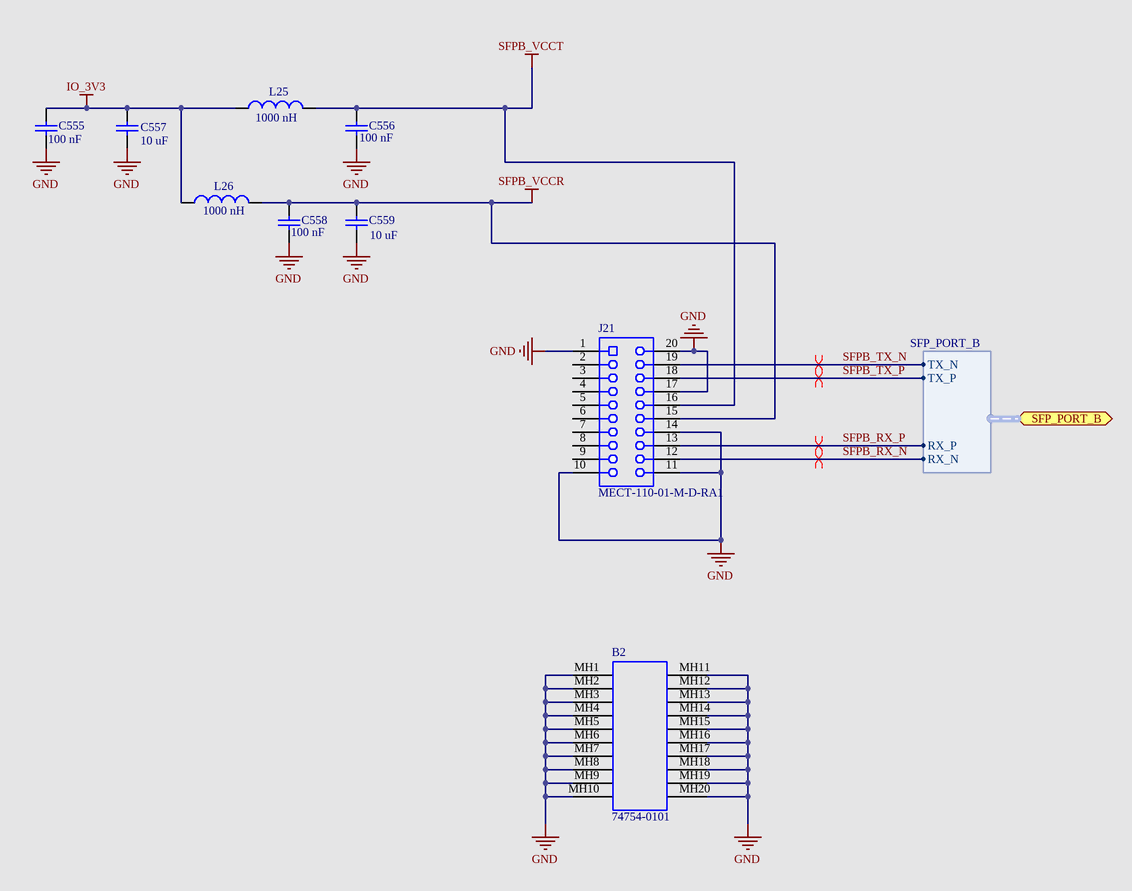
[diagram p26: SFP_PortB.SchDoc]

### Parts
B2  74754-0101  [MOLX-74754-0101_V]
C555  Capacitance: 100 nF  [CAPC1005X55X10LL05]  (hidden comment: C1005X7R1E104M)
C556  Capacitance: 100 nF  [CAPC1005X55X10LL05]  (hidden comment: C1005X7R1E104M)
C557  Capacitance: 10 uF  [CAPC2013X100X20NL20]  (hidden comment: C2012X5R1C106K085AC)
C558  Capacitance: 100 nF  [CAPC1005X55X10LL05]  (hidden comment: C1005X7R1E104M)
C559  Capacitance: 10 uF  [CAPC2013X100X20NL20]  (hidden comment: C2012X5R1C106K085AC)
J21  MECT-110-01-M-D-RA1  [SMTC-MECT-110-01-M-D-RA1_V]
L25  Inductance: 1000 nH  [COIL-1008CS_V]  (hidden comment: 1008CS-102XFLC)
L26  Inductance: 1000 nH  [COIL-1008CS_V]  (hidden comment: 1008CS-102XFLC)

### Ports
SFP_PORT_B (harness SFP_PORT_B)

### Harnesses
SFP_PORT_B: TX_P, TX_N, RX_P, RX_N

### Nets
GND: B2.MH1 B2.MH2 B2.MH3 B2.MH4 B2.MH5 B2.MH6 B2.MH7 B2.MH8 B2.MH9 B2.MH10 B2.MH11 B2.MH12 B2.MH13 B2.MH14 B2.MH15 B2.MH16 B2.MH17 B2.MH18 B2.MH19 B2.MH20 C555.1 C556.1 C557.1 C558.1 C559.1 J21.1 J21.10 J21.11 J21.14 J21.17 J21.20
IO_3V3: C555.2 C557.2 L25.1 L26.1
SFPB_VCCR: C558.2 C559.2 J21.15 L26.2
SFPB_VCCT: C556.2 J21.16 L25.2
SFPB_RX_N: J21.12 ; port SFP_PORT_B.RX_N
SFPB_RX_P: J21.13 ; port SFP_PORT_B.RX_P
SFPB_TX_N: J21.19 ; port SFP_PORT_B.TX_N
SFPB_TX_P: J21.18 ; port SFP_PORT_B.TX_P

Not connected (* = marked no-connect by the designer): J21 2 3 4 5 6 7 8 9

### Layout directives
differential pair: SFPB_RX_N, SFPB_RX_P, SFPB_TX_N, SFPB_TX_P

### Notes on the sheet
- Title
- Size:
- Date:
- B
- Number:
- Time:
- Revision:
- Sheet
- of
- File:

### Library data of the parts
B2 = CMP-1704-00003-1: as B1 on sheet SFP_PortA; ComponentLink1URL: http://www.molex.com/; PartNumber: 74754-0101; Mounting Technology: Through Hole; PackageDescription: SFP+ Cage, Single Port, Height 10.85 mm, Tail Height 3.05 mm; ComponentLink2Description: Datasheet; DatasheetVersion: Rev. Jul-15; PackageVersion: Rev. J, 02/2015; ComponentLink1Description: Manufacturer URL; ComponentLink2URL: http://www.molex.com/webdocs/datasheets/pdf/en-us/0747540101_IO_CONNECTORS.pdf; ComponentLink3Description: Package Specification; PackageReference: 74754-0101; ComponentLink3URL: http://www.molex.com/pdm_docs/sd/747540101_sd.pdf
C555 C556 C558 = CMP-1663-00009-2: as C369 on sheet Ethernet-HPS; Tolerance: 20%; Max Operating Temperature: 125 degC; ComponentLink2URL: http://www.farnell.com/datasheets/1571323.pdf; ComponentLink1URL: http://www.tdk.com/; RoHSCompliant: true; Packaging: Tape and Reel; Mounting Technology: Surface Mount; ComponentLink2Description: Datasheet; Case Code (Imperial): 0402; DatasheetVersion: 09/2011; ComponentLink1Description: Manufacturer URL; PackageDescription: 2-Pin Surface Mount Device, Body 1 x 0.5 mm; PackageReference: 0402; Min Operating Temperature: -55 degC; Case Code (Metric): 1005; Height: 0.5 mm; Package Quantity: 10000; Width: 0.5 mm; Pins: 2; Voltage Rating (DC): 25 V; PartNumber: C1005X7R1E104M; Mount: Surface Mount; Length: 1 mm
C557 C559 = CMP-1663-00007-1: as C370 on sheet Ethernet-HPS; Tolerance: 10%; Mounting Technology: Surface Mount; Min Operating Temperature: -55 degC; Length: 2 mm; Case Code (Metric): 2012; PackageReference: 0805; Voltage Rating: 16 V; RoHSCompliant: true; ComponentLink1Description: Manufacturer URL; Width: 1.25 mm; ComponentLink1URL: http://www.tdk.com/; Max Operating Temperature: 85 degC; REACH SVHC: No SVHC; Mount: Surface Mount; ComponentLink2URL: https://product.tdk.com/info/en/catalog/datasheets/mlcc_commercial_general_en.pdf; ComponentLink2Description: Datasheet; Pins: 2; Packaging: Tape and Reel; Height: 0.85 mm; Package Quantity: 1; DatasheetVersion: 03/2015; Case Code (Imperial): 0805; PackageDescription: 2-Pin Surface Mount Device, Body 2 x 1.25 mm
J21 = CMP-1707-00001-1: as J7 on sheet SFP_PortA; ComponentLink1URL: http://www.samtec.com/; ComponentLink2Description: Datasheet; ComponentLink2URL: http://suddendocs.samtec.com/catalog_english/mect.pdf; PartNumber: MECT-110-01-M-D-RA1; PackageDescription: Female Transceiver Interface, Pitch 0.8 mm, 2 x 10 Position, Height 5.2 mm; Mounting Technology: Surface Mount; ComponentLink3Description: Package Specification; ComponentLink1Description: Manufacturer URL; DatasheetVersion: Rev. Feb-16; PackageReference: MECT-110-01-M-D-RA1; PackageVersion: Rev. H, 06/2016; ComponentLink3URL: http://suddendocs.samtec.com/prints/mect-1xx-xx-xx-xx-d-rax-xx-footprint.pdf
L25 L26 = CMP-1716-00001-2: as L23 on sheet SFP_PortA; DatasheetVersion: 01/2012; ComponentLink2URL: http://datasheet.octopart.com/1008CS-102XFLC-Coilcraft-datasheet-10791557.pdf; ComponentLink1Description: Manufacturer URL; PartNumber: 1008CS-102XFLC; ComponentLink1URL: http://www.coilcraft.com/; PackageDescription: 2-Pin Surface Mount Device, Body 2.92 x 2.79 mm; RoHSCompliant: False; ComponentLink2Description: Datasheet; Mounting Technology: Surface Mount

## Sheet JTAG_Connector.SchDoc: JTAG Connector
size A; DocumentNumber: 9; SheetNumber: 9; SheetTotal: 46
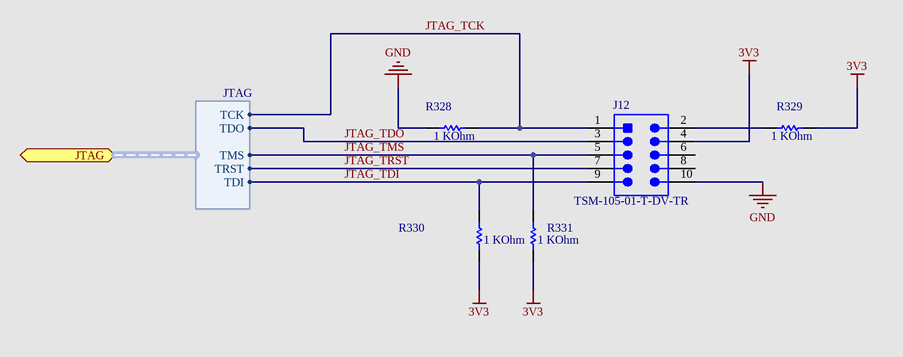
[diagram p27: JTAG_Connector.SchDoc]

### Parts
J12  TSM-105-01-T-DV-TR  [SMTC-TSM-105-01-T-DV_V]
R328  Resistance: 1 KOhm  [RESC1005X40X25LL05T05]  (hidden comment: ERJ-2RKF1001X)
R329  Resistance: 1 KOhm  [RESC1005X40X25LL05T05]  (hidden comment: ERJ-2RKF1001X)
R330  Resistance: 1 KOhm  [RESC1005X40X25LL05T05]  (hidden comment: ERJ-2RKF1001X)
R331  Resistance: 1 KOhm  [RESC1005X40X25LL05T05]  (hidden comment: ERJ-2RKF1001X)

### Ports
JTAG (harness JTAG)

### Harnesses
JTAG: TDI, TDO, TCK, TMS, TRST

### Nets
3V3: J12.4 R329.2 R330.1 R331.1
GND: J12.10 R328.1
JTAG_TCK: J12.1 R328.2 ; port JTAG.TCK
JTAG_TDI: J12.9 R330.2 ; port JTAG.TDI
JTAG_TDO: J12.3 ; port JTAG.TDO
JTAG_TMS: J12.5 R331.2 ; port JTAG.TMS
JTAG_TRST: J12.7 ; port JTAG.TRST
NetJ12_2: J12.2 R329.1

Not connected (* = marked no-connect by the designer): J12 6 8

### Notes on the sheet
- Title
- Size:
- Date:
- A
- Number:
- Time:
- Revision:
- Sheet
- of
- File:

### Library data of the parts
J12 = CMP-1707-00003-3: Male Header, Pitch 2.54 mm, 2 x 5 Position, Height 9.65 mm, -55 to 105 degC, RoHS, Tape and Reel; Max Operating Temperature: 105 degC; ComponentLink1URL: http://www.samtec.com/; Min Operating Temperature: -55 degC; ComponentLink2URL: http://suddendocs.samtec.com/catalog_english/tsm.pdf; ComponentLink2Description: Datasheet; Mounting Technology: Surface Mount; Pins: 10; DatasheetVersion: Rev. 31DEC15; PackageDescription: Male Header, Pitch 2.54 mm, 2 x 5 Position, Height 9.65 mm; Height: 9.65 mm; ComponentLink3URL: http://suddendocs.samtec.com/prints/tsm-dv-footprint.pdf; Packaging: Tape and Reel; Radiation Hardening: No; ComponentLink3Description: Package Specification; RoHSCompliant: True; REACH SVHC: No SVHC; Length: 12.7 mm; PartNumber: TSM-105-01-T-DV-TR; Mount: Surface Mount; ComponentLink1Description: Manufacturer URL
R328-R331 = CMP-2002-00606-3: as R315 on sheet Ethernet-HPS; PartNumber: ERJ-2RKF1001X; Width: 0.5 mm; ComponentLink1URL: http://www.panasonic.com/; Length: 1 mm; Min Operating Temperature: -55 degC; PackageDescription: 2-Pin Surface Mount Device, Body 1 x 0.5 mm; Case Code (Metric): 1005; Height: 0.35 mm; ComponentLink1Description: Manufacturer URL; Mounting Technology: Surface Mount; Tolerance: 1%; Packaging: Tape and Reel; Package Quantity: 10000; REACH SVHC: Yes; Max Operating Temperature: 155 degC; Mount: Surface Mount; RoHSCompliant: true; Case Code (Imperial): 0402; DatasheetVersion: 04/2015; Radiation Hardening: No; Pins: 2; ComponentLink2Description: Datasheet; PackageReference: 0402; ComponentLink2URL: http://industrial.panasonic.com/cdbs/www-data/pdf/RDA0000/AOA0000C86.pdf

## Sheet Display_Port.SchDoc: Display Port (x4)
size B; DocumentNumber: 5; SheetNumber: 5; SheetTotal: 46
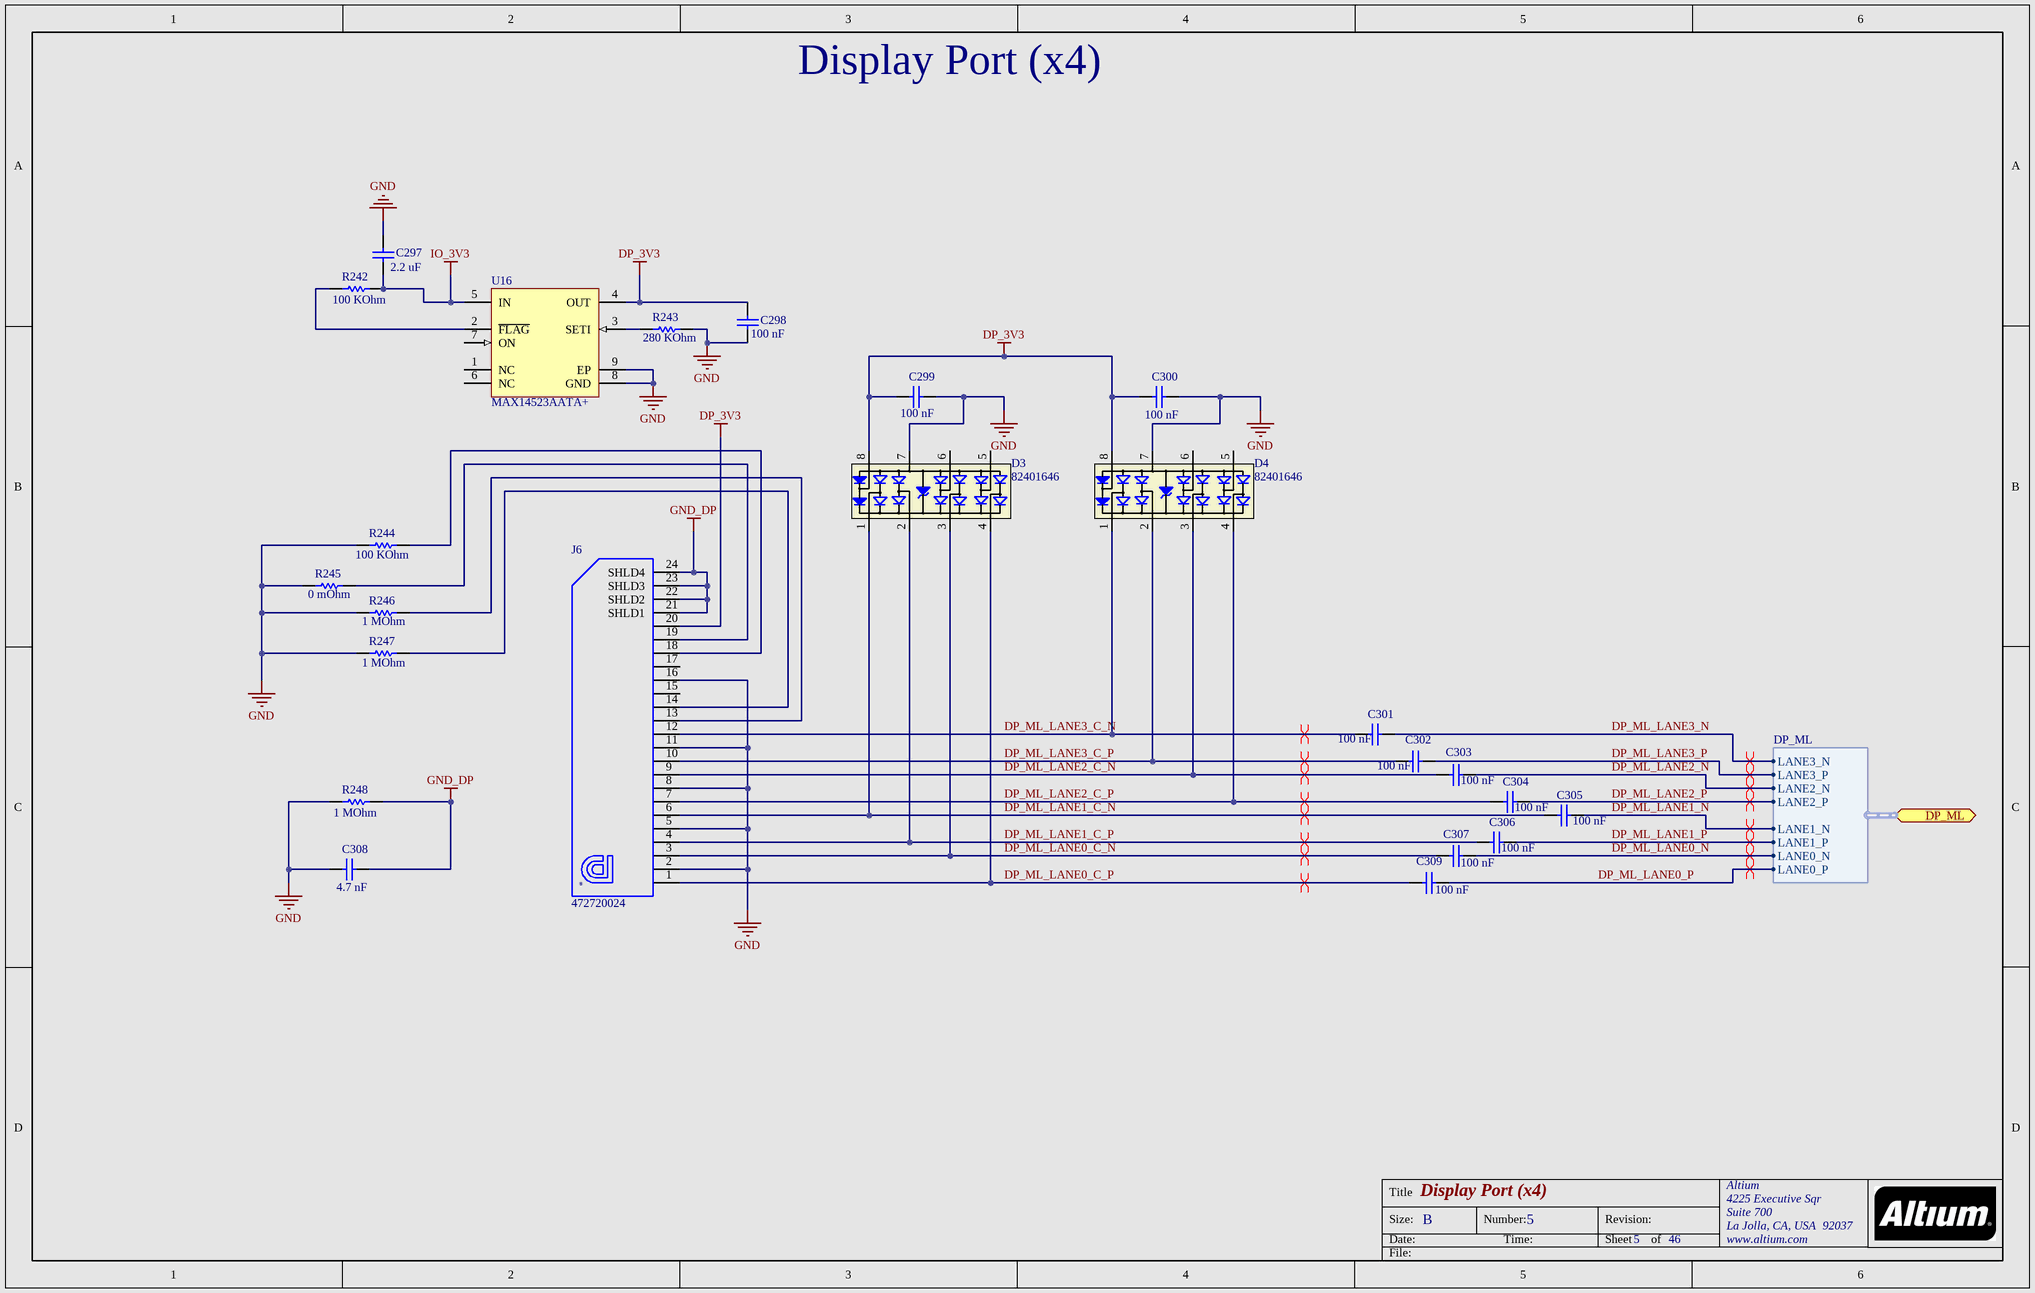
[diagram p28: Display_Port.SchDoc]

### Parts
C297  Capacitance: 2.2 uF  [CAPC1608X90X35ML10T15]  (hidden comment: GRM188R61A225KE34x)
C298  Capacitance: 100 nF  [CAPC1005X55X10LL05]  (hidden comment: C1005X7R1E104M)
C299  Capacitance: 100 nF  [CAPC1005X55X10LL05]  (hidden comment: C1005X7R1E104M)
C300  Capacitance: 100 nF  [CAPC1005X55X10LL05]  (hidden comment: C1005X7R1E104M)
C301  Capacitance: 100 nF  [CAPC1005X55X10LL05]  (hidden comment: C1005X7R1E104M)
C302  Capacitance: 100 nF  [CAPC1005X55X10LL05]  (hidden comment: C1005X7R1E104M)
C303  Capacitance: 100 nF  [CAPC1005X55X10LL05]  (hidden comment: C1005X7R1E104M)
C304  Capacitance: 100 nF  [CAPC1005X55X10LL05]  (hidden comment: C1005X7R1E104M)
C305  Capacitance: 100 nF  [CAPC1005X55X10LL05]  (hidden comment: C1005X7R1E104M)
C306  Capacitance: 100 nF  [CAPC1005X55X10LL05]  (hidden comment: C1005X7R1E104M)
C307  Capacitance: 100 nF  [CAPC1005X55X10LL05]  (hidden comment: C1005X7R1E104M)
C308  Capacitance: 4.7 nF  [CAPC1005X55X25NL05T10]  (hidden comment: GRM155R71H472KA01D)
C309  Capacitance: 100 nF  [CAPC1005X55X10LL05]  (hidden comment: C1005X7R1E104M)
D3  82401646  [MSOP-8L]
D4  82401646  [MSOP-8L]
J6  472720024  [MOLX-472720024_V]
R242  Resistance: 100 KOhm  [RESC1005X40X25LL05T05]  (hidden comment: ERJ-2RKF1003X)
R243  Resistance: 280 KOhm  [RESC1005X40X25LL05T05]  (hidden comment: ERJ-2RKF2803X)
R244  Resistance: 100 KOhm  [RESC1005X40X25LL05T05]  (hidden comment: ERJ-2RKF1003X)
R245  Resistance: 0 mOhm  [RESC1005X40X25ML05T05]  (hidden comment: ERJ-2GE0R00X)
R246  Resistance: 1 MOhm  [RESC1005X40X25LL05T05]  (hidden comment: ERJ-2RKF1004X)
R247  Resistance: 1 MOhm  [RESC1005X40X25LL05T05]  (hidden comment: ERJ-2RKF1004X)
R248  Resistance: 1 MOhm  [RESC1005X40X25LL05T05]  (hidden comment: ERJ-2RKF1004X)
U16  MAX14523AATA+  [MAXM-T833+2_V]

### Ports
DP_ML (harness DP_ML)

### Harnesses
DP_ML: LANE2_P, LANE2_N, LANE3_P, LANE3_N, LANE1_N, LANE1_P, LANE0_N, LANE0_P

### Nets
DP_3V3: C298.2 C299.2 C300.2 D3.8(VDD) D4.8(VDD) J6.20 U16.4(OUT)
GND: C297.2 C298.1 C299.1 C300.1 C308.1 D3.7(GND) D4.7(GND) J6.2 J6.5 J6.8 J6.11 J6.16 R243.2 R244.1 R245.1 R246.1 R247.1 R248.1 U16.8(GND) U16.9(EP)
GND_DP: C308.2 J6.21(SHLD1) J6.22(SHLD2) J6.23(SHLD3) J6.24(SHLD4) R248.2
IO_3V3: C297.1 R242.2 U16.5(IN)
DP_ML_LANE0_C_N: C307.2 D3.3(I/O3) J6.3
DP_ML_LANE0_C_P: C309.2 D3.4(I/O4) J6.1
DP_ML_LANE0_N: C307.1 ; port DP_ML.LANE0_N
DP_ML_LANE0_P: C309.1 ; port DP_ML.LANE0_P
DP_ML_LANE1_C_N: C305.2 D3.1(I/O1) J6.6
DP_ML_LANE1_C_P: C306.2 D3.2(I/O2) J6.4
DP_ML_LANE1_N: C305.1 ; port DP_ML.LANE1_N
DP_ML_LANE1_P: C306.1 ; port DP_ML.LANE1_P
DP_ML_LANE2_C_N: C303.2 D4.3(I/O3) J6.9
DP_ML_LANE2_C_P: C304.2 D4.4(I/O4) J6.7
DP_ML_LANE2_N: C303.1 ; port DP_ML.LANE2_N
DP_ML_LANE2_P: C304.1 ; port DP_ML.LANE2_P
DP_ML_LANE3_C_N: C301.2 D4.1(I/O1) J6.12
DP_ML_LANE3_C_P: C302.2 D4.2(I/O2) J6.10
DP_ML_LANE3_N: C301.1 ; port DP_ML.LANE3_N
DP_ML_LANE3_P: C302.1 ; port DP_ML.LANE3_P
NetJ6_13: J6.13 R246.2
NetJ6_14: J6.14 R247.2
NetJ6_18: J6.18 R244.2
NetJ6_19: J6.19 R245.2
NetR242_1: R242.1 U16.2(~{FLAG})
NetR243_1: R243.1 U16.3(SETI)

Not connected (* = marked no-connect by the designer): D3 5(I/O5) 6(I/O6); D4 5(I/O5) 6(I/O6); J6 15 17; U16 1(NC) 6(NC) 7(ON)

### Layout directives
differential pair: DP_ML_LANE0_C_N, DP_ML_LANE0_C_P, DP_ML_LANE0_N, DP_ML_LANE0_P, DP_ML_LANE1_C_N, DP_ML_LANE1_C_P, DP_ML_LANE1_N, DP_ML_LANE1_P, DP_ML_LANE2_C_N, DP_ML_LANE2_C_P, DP_ML_LANE2_N, DP_ML_LANE2_P, DP_ML_LANE3_C_N, DP_ML_LANE3_C_P, DP_ML_LANE3_N, DP_ML_LANE3_P

### Notes on the sheet
- Title
- Size:
- Date:
- B
- Number:
- Time:
- Revision:
- Sheet
- of
- File:
- (in symbol CMP-1704-00002-1) ®

### Library data of the parts
C297 = CMP-1662-00016-2: as C368 on sheet Ethernet-HPS; Tolerance: 10%; Width: 0.031 inch; DatasheetVersion: 01/2013; Case/Package: 0603; Length: 0.063 inch; PartNumber: GRM188R61A225KE34x; Package Quantity: 10000; Case Code (Imperial): 0603; Packaging: Tape and Reel; PackageDescription: 2-Pin Surface Mount Device, Body 1.6 x 0.8 mm; Case Code (Metric): 1608; ComponentLink1Description: Manufacturer URL; Radiation Hardening: No; Mounting Technology: Surface Mount; Height: 0.8 mm; RoHSCompliant: True; ComponentLink2URL: https://datasheet.ciiva.com/134/grm188r61a225ke34-01-134206.pdf; ComponentLink2Description: Datasheet; Max Operating Temperature: 85 degC; Min Operating Temperature: -55 degC; ComponentLink1URL: http://www.murata.com/
C298-C307 C309 = CMP-1663-00009-2: as C369 on sheet Ethernet-HPS; Tolerance: 20%; Max Operating Temperature: 125 degC; ComponentLink2URL: http://www.farnell.com/datasheets/1571323.pdf; ComponentLink1URL: http://www.tdk.com/; RoHSCompliant: true; Packaging: Tape and Reel; Mounting Technology: Surface Mount; ComponentLink2Description: Datasheet; Case Code (Imperial): 0402; DatasheetVersion: 09/2011; ComponentLink1Description: Manufacturer URL; PackageDescription: 2-Pin Surface Mount Device, Body 1 x 0.5 mm; PackageReference: 0402; Min Operating Temperature: -55 degC; Case Code (Metric): 1005; Height: 0.5 mm; Package Quantity: 10000; Width: 0.5 mm; Pins: 2; Voltage Rating (DC): 25 V; PartNumber: C1005X7R1E104M; Mount: Surface Mount; Length: 1 mm
C308 = CMP-2008-04663-4: Chip Capacitor, 4.7 nF, +/- 10%, 50 V, -55 to 125 degC, 0402 (1005 Metric), RoHS, Tape and Reel; Manufacturer: Basic Passives; Voltage Rating: 50 V; Case\/Package: 0402; Type (Capacitors): X7R; Case Code (Metric): 1005; Case Code (Imperial): 0402; RoHSCompliant: true; Length: 1 mm; PartNumber: GRM155R71H472KA01D; Width: 0.5 mm; PackageDescription: 2-Pin Surface Mount Device, Body 1 x 0.5 mm; ComponentLink1URL: http://www.murata.com/; Package Quantity: 1; Packaging: Cut Tape; Tolerance: 10%; Height: 0.5 mm; Max Operating Temperature: 125 degC; ComponentLink1Description: Manufacturer URL; Min Operating Temperature: -55 degC; REACH SVHC: No SVHC; Mounting Technology: Surface Mount; ComponentLink2URL: http://search.murata.co.jp/Ceramy/image/img/A01X/G101/ENG/GRM155R71H472KA01-01.pdf; Mount: Surface Mount; Voltage Rating (DC): 50 V; PackageReference: 0402; DatasheetVersion: 02/2016; Radiation Hardening: No; Pins: 2; Lead Pitch: 2 mm; ComponentLink2Description: Datasheet
D3 D4 = CMP-1482-00002-1: TVS Diode WE-TVS-SS, VRWM=5V; Manufacturer: Wuerth Elektronik; Reverse Stand Off Voltage: 5V; ComponentLink1URL: http://www.we-online.com; PartNumber: 82401646; ComponentLink2Description: Datasheet; PackageReference: MSOP-8L; ComponentLink1Description: Manufacturer URL; ComponentLink2URL: http://katalog.we-online.de/kataloge/eisos/media/pdf/82401646.pdf
J6 = CMP-1704-00002-1: DisplayPort Connector, Pitch 0.5 mm, 1 x 20 Position, Height 6.65 mm, -20 to 85 degC, RoHS, Tape and Reel; Manufacturer: Molex; ComponentLink2URL: http://www.molex.com/pdm_docs/sd/472720024_sd.pdf; PackageReference: 472720024; ComponentLink2Description: Datasheet; DatasheetVersion: Rev. F; PackageDescription: DisplayPort Connector, Pitch 0.5 mm, 1 x 20 Position, Height 6.65 mm; ComponentLink1URL: http://www.molex.com/; Mounting Technology: Surface Mount; PartNumber: 472720024; ComponentLink1Description: Manufacturer URL
R242 R244 = CMP-2002-00608-3: Chip Resistor, 100 KOhm, +/- 1%, 100 mW, -55 to 155 degC, 0402 (1005 Metric), RoHS, Tape and Reel; Manufacturer: Basic Passives; Voltage Rating: 50 V; Power Rating: 100 mW; Case\/Package: 0402; Height: 0.35 mm; ComponentLink1Description: Manufacturer URL; Packaging: Tape and Reel; Min Operating Temperature: -55 degC; RoHSCompliant: true; PackageDescription: 2-Pin Surface Mount Device, Body 1 x 0.5 mm; Mount: Surface Mount; Package Quantity: 10000; Max Operating Temperature: 155 degC; ComponentLink1URL: http://www.panasonic.com/; Tolerance: 1%; Mounting Technology: Surface Mount; PartNumber: ERJ-2RKF1003X; Case Code (Metric): 1005; Case Code (Imperial): 0402; REACH SVHC: Yes; Length: 1 mm; Width: 0.5 mm; DatasheetVersion: 04/2015; Pins: 2; ComponentLink2Description: Datasheet; ComponentLink2URL: http://industrial.panasonic.com/cdbs/www-data/pdf/RDA0000/AOA0000C86.pdf; PackageReference: 0402; Radiation Hardening: No
R243 = CMP-2002-00835-3: Chip Resistor, 280 KOhm, +/- 1%, 100 mW, -55 to 155 degC, 0402 (1005 Metric), RoHS, Cut Tape; Manufacturer: Basic Passives; Power Rating: 100 mW; Voltage Rating: 50 V; Case\/Package: 0402; Mount: Surface Mount; Width: 0.02 inch; Max Operating Temperature: 155 degC; REACH SVHC: Yes; Min Operating Temperature: -55 degC; PartNumber: ERJ-2RKF2803X; Mounting Technology: Surface Mount; ComponentLink1URL: http://www.panasonic.com/; Packaging: Cut Tape; Case Code (Imperial): 0402; ComponentLink1Description: Manufacturer URL; Tolerance: 1%; PackageDescription: 2-Pin Surface Mount Device, Body 1 x 0.5 mm; Package Quantity: 10000; Height: 0.016 inch; Length: 0.039 inch; Case Code (Metric): 1005; RoHSCompliant: true; ComponentLink2Description: Datasheet; PackageReference: 0402; ComponentLink2URL: http://industrial.panasonic.com/cdbs/www-data/pdf/RDA0000/AOA0000C86.pdf; Pins: 2; DatasheetVersion: 04/2015
R245 = CMP-2002-00429-3: Chip Resistor, 0 mOhm, +/- 5%, 100 mW, -55 to 155 degC, 0402 (1005 Metric), RoHS, Tape and Reel; Manufacturer: Basic Passives; Power Rating: 100 mW; Voltage Rating: 50 V; Case\/Package: 0402; Max Operating Temperature: 155 degC; Tolerance: 5%; PartNumber: ERJ-2GE0R00X; Case Code (Imperial): 0402; Package Quantity: 10000; Length: 1 mm; Mounting Technology: Surface Mount; ComponentLink1URL: http://www.panasonic.com/; Height: 0.35 mm; Width: 0.5 mm; Min Operating Temperature: -55 degC; Case Code (Metric): 1005; RoHSCompliant: true; REACH SVHC: Unknown; ComponentLink1Description: Manufacturer URL; Packaging: Tape and Reel; Mount: Surface Mount; PackageDescription: 2-Pin Surface Mount Device, Body 1 x 0.5 mm; PackageReference: 0402; ComponentLink2URL: http://industrial.panasonic.com/cdbs/www-data/pdf/RDA0000/AOA0000C84.pdf; DatasheetVersion: 03/2015; Radiation Hardening: No; Pins: 2; ComponentLink2Description: Datasheet
R246-R248 = CMP-2002-00609-3: Chip Resistor, 1 MOhm, +/- 1%, 100 mW, -55 to 155 degC, 0402 (1005 Metric), RoHS, Tape and Reel; Manufacturer: Basic Passives; Power Rating: 100 mW; Voltage Rating: 50 V; Case\/Package: 0402; Mount: Surface Mount; PartNumber: ERJ-2RKF1004X; Height: 0.35 mm; PackageDescription: 2-Pin Surface Mount Device, Body 1 x 0.5 mm; Max Operating Temperature: 155 degC; Mounting Technology: Surface Mount; Case Code (Metric): 1005; REACH SVHC: Yes; Length: 1 mm; ComponentLink1URL: http://www.panasonic.com/; Min Operating Temperature: -55 degC; Width: 0.5 mm; Tolerance: 1%; Package Quantity: 10000; ComponentLink1Description: Manufacturer URL; RoHSCompliant: true; Packaging: Tape and Reel; Case Code (Imperial): 0402; Pins: 2; ComponentLink2URL: http://industrial.panasonic.com/cdbs/www-data/pdf/RDA0000/AOA0000C86.pdf; Weight: 2.8E-05oz; Radiation Hardening: No; ComponentLink2Description: Datasheet; DatasheetVersion: 04/2015; PackageReference: 0402
U16 = CMP-0247-00012-3: Adjustable Current-Limit Switch, 1.7 to 5.5 V, -40 to 125 degC, 8-Pin TDFN (T833+2), RoHS; Manufacturer: Maxim; ILIM: 0.25 to 1.5 A; RON: 70 mOhm Typ.; IQ: 170 uA Typ.; VIH: 1.6 V Min.; VIL: 0.4 V Max.; PartNumber: MAX14523AATA+; Operating Temperature: -40 to 125 degC; Mounting Technology: Surface Mount; VIN: 1.7 to 5.5 V; ComponentLink3Description: Package Specification; ComponentLink2URL: http://datasheets.maximintegrated.com/en/ds/MAX14523A-MAX14523C.pdf; PackageVersion: Mar-14; ComponentLink1URL: http://www.maximintegrated.com/; ComponentLink3URL: http://pdfserv.maximintegrated.com/package_dwgs/21-0137.PDF; ComponentLink1Description: Manufacturer URL; RoHS: TRUE; PackageDescription: 8-Pin SON, Body 3 x 3 mm, Pitch 0.65 mm; ComponentLink2Description: Datasheet; DatasheetVersion: Rev. 1